# Altium schematic sheet DRV8833.SchDoc
size A4; SheetNumber: 7; SheetTotal: 7
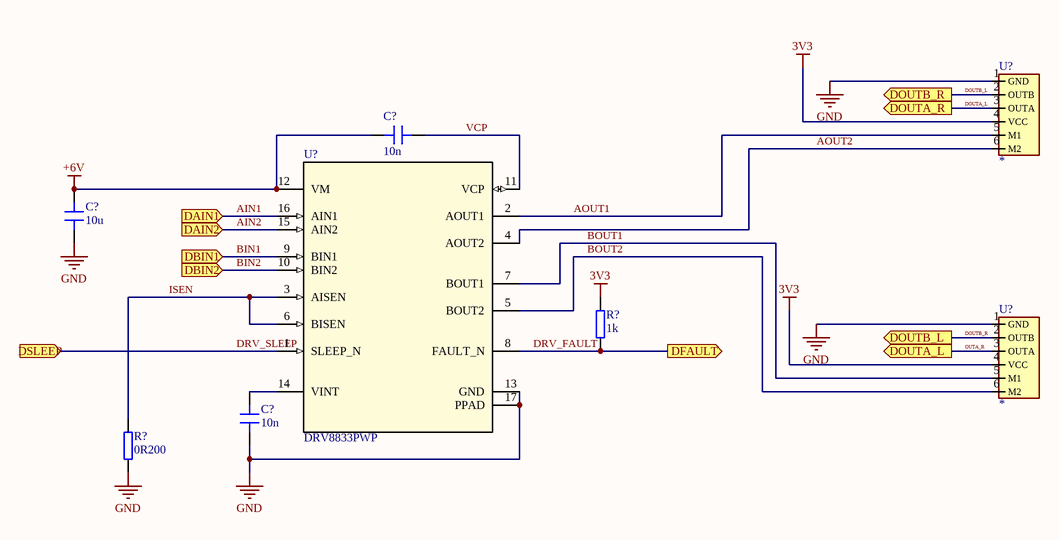
[diagram p0: DRV8833.SchDoc]

## Parts
(Parts that share a designator on the sheet are numbered #1, #2 ... from top to bottom, then left to right.)
C?#1  10n
C?#2  10u
C?#3  10n
R?#1  1k
R?#2  0R200
U?#1  *  [HEADER6]
U?#2  DRV8833PWP  [PWP0016C_N]
U?#3  *  [HEADER6]

## Ports
DAIN1 (in), DAIN2 (in), DBIN1 (in), DBIN2 (in), DFAULT (out), DOUTA_L (out), DOUTA_R (out), DOUTB_L (out), DOUTB_R (out), DSLEEP (in)

## Nets
3V3: R?#1.1 U?#1.4(VCC) U?#3.4(VCC)
+6V: C?#1.1 C?#2.2 U?#2.12(VM)
GND: C?#2.1 C?#3.1 R?#2.1 U?#1.1(GND) U?#2.13(GND) U?#2.17(PPAD) U?#3.1(GND)
AIN1: U?#2.16(AIN1) ; port DAIN1
AIN2: U?#2.15(AIN2) ; port DAIN2
AOUT1: U?#1.5(M1) U?#2.2(AOUT1)
AOUT2: U?#1.6(M2) U?#2.4(AOUT2)
BIN1: U?#2.9(BIN1) ; port DBIN1
BIN2: U?#2.10(BIN2) ; port DBIN2
BOUT1: U?#2.7(BOUT1) U?#3.5(M1)
BOUT2: U?#2.5(BOUT2) U?#3.6(M2)
DOUTA_L: U?#1.3(OUTA) ; port DOUTA_R
DOUTB_L: U?#1.2(OUTB) ; port DOUTB_R
DOUTB_R: U?#3.2(OUTB) ; port DOUTB_L
DRV_FAULT: R?#1.2 U?#2.8(FAULT_N) ; port DFAULT
DRV_SLEEP: U?#2.1(SLEEP_N) ; port DSLEEP
ISEN: R?#2.2 U?#2.3(AISEN) U?#2.6(BISEN)
OUTA_R: U?#3.3(OUTA) ; port DOUTA_L
VCP: C?#1.2 U?#2.11(VCP)
NetC?#3_2: C?#3.2 U?#2.14(VINT)

## Library data of the parts
C?#1-C?#3 = Capacitor: Value: *; HelpURL: *; MPN: *; Supplier: *; SupplierPartNumber: *
R?#1 R?#2 = Resistor: Value: *; HelpURL: *; MPN: *; Supplier: *; SupplierPartNumber: *
U?#1 U?#3 = 6PINH: Value: *; HelpURL: *; MPN: *; Supplier: *; SupplierPartNumber: *
U?#2 = DRV8833PWP: No Description Available; Mfr_Name: Texas Instruments; Type: DEV; RefDes: RefDes; Copyright: Copyright (C) 2023 Ultra Librarian. All rights reserved.; Manufacturer_Part_Number: DRV8833PWP